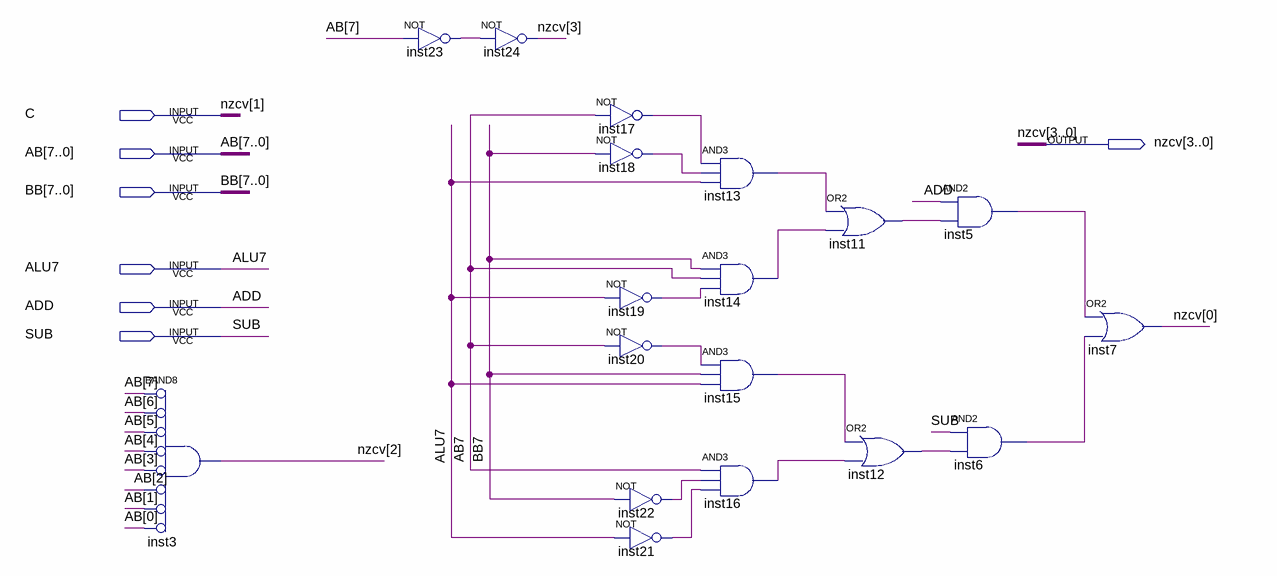
[diagram p0: schematic sheet]
// Quartus schematic nzcvGenSema.bdf as structural Verilog: 18 symbols, 7 pins
module nzcvGenSema (
  input  C,
  input  [7:0] AB,
  input  [7:0] BB,
  input  ALU7,
  input  ADD,
  input  SUB,
  output [3:0] nzcv
);

  wire inst5_out, inst6_out, inst11_out, inst12_out, inst13_out, inst14_out, inst15_out, inst16_out,
       inst17_out, inst18_out, inst19_out, inst20_out, inst21_out, inst22_out, inst23_out;

  and inst3 (nzcv[2], ~AB[7], ~AB[6], ~AB[5], ~AB[4], ~AB[3], ~AB[2], ~AB[1], ~AB[0]);  // BAND8
  not inst23 (inst23_out, AB[7]);
  not inst24 (nzcv[3], inst23_out);
  not inst17 (inst17_out, AB[7]);
  not inst18 (inst18_out, BB[7]);
  not inst19 (inst19_out, ALU7);
  not inst20 (inst20_out, AB[7]);
  not inst22 (inst22_out, BB[7]);
  not inst21 (inst21_out, ALU7);
  and inst13 (inst13_out, inst17_out, inst18_out, ALU7);
  and inst14 (inst14_out, BB[7], AB[7], inst19_out);
  and inst15 (inst15_out, inst20_out, BB[7], ALU7);
  and inst16 (inst16_out, AB[7], inst22_out, inst21_out);
  or inst11 (inst11_out, inst13_out, inst14_out);
  or inst12 (inst12_out, inst15_out, inst16_out);
  and inst5 (inst5_out, ADD, inst11_out);
  and inst6 (inst6_out, SUB, inst12_out);
  or inst7 (nzcv[0], inst5_out, inst6_out);

  assign nzcv[1] = C;
endmodule
